# EAGLE design Hypnos V3.2 (EAGLE 9.6.2)
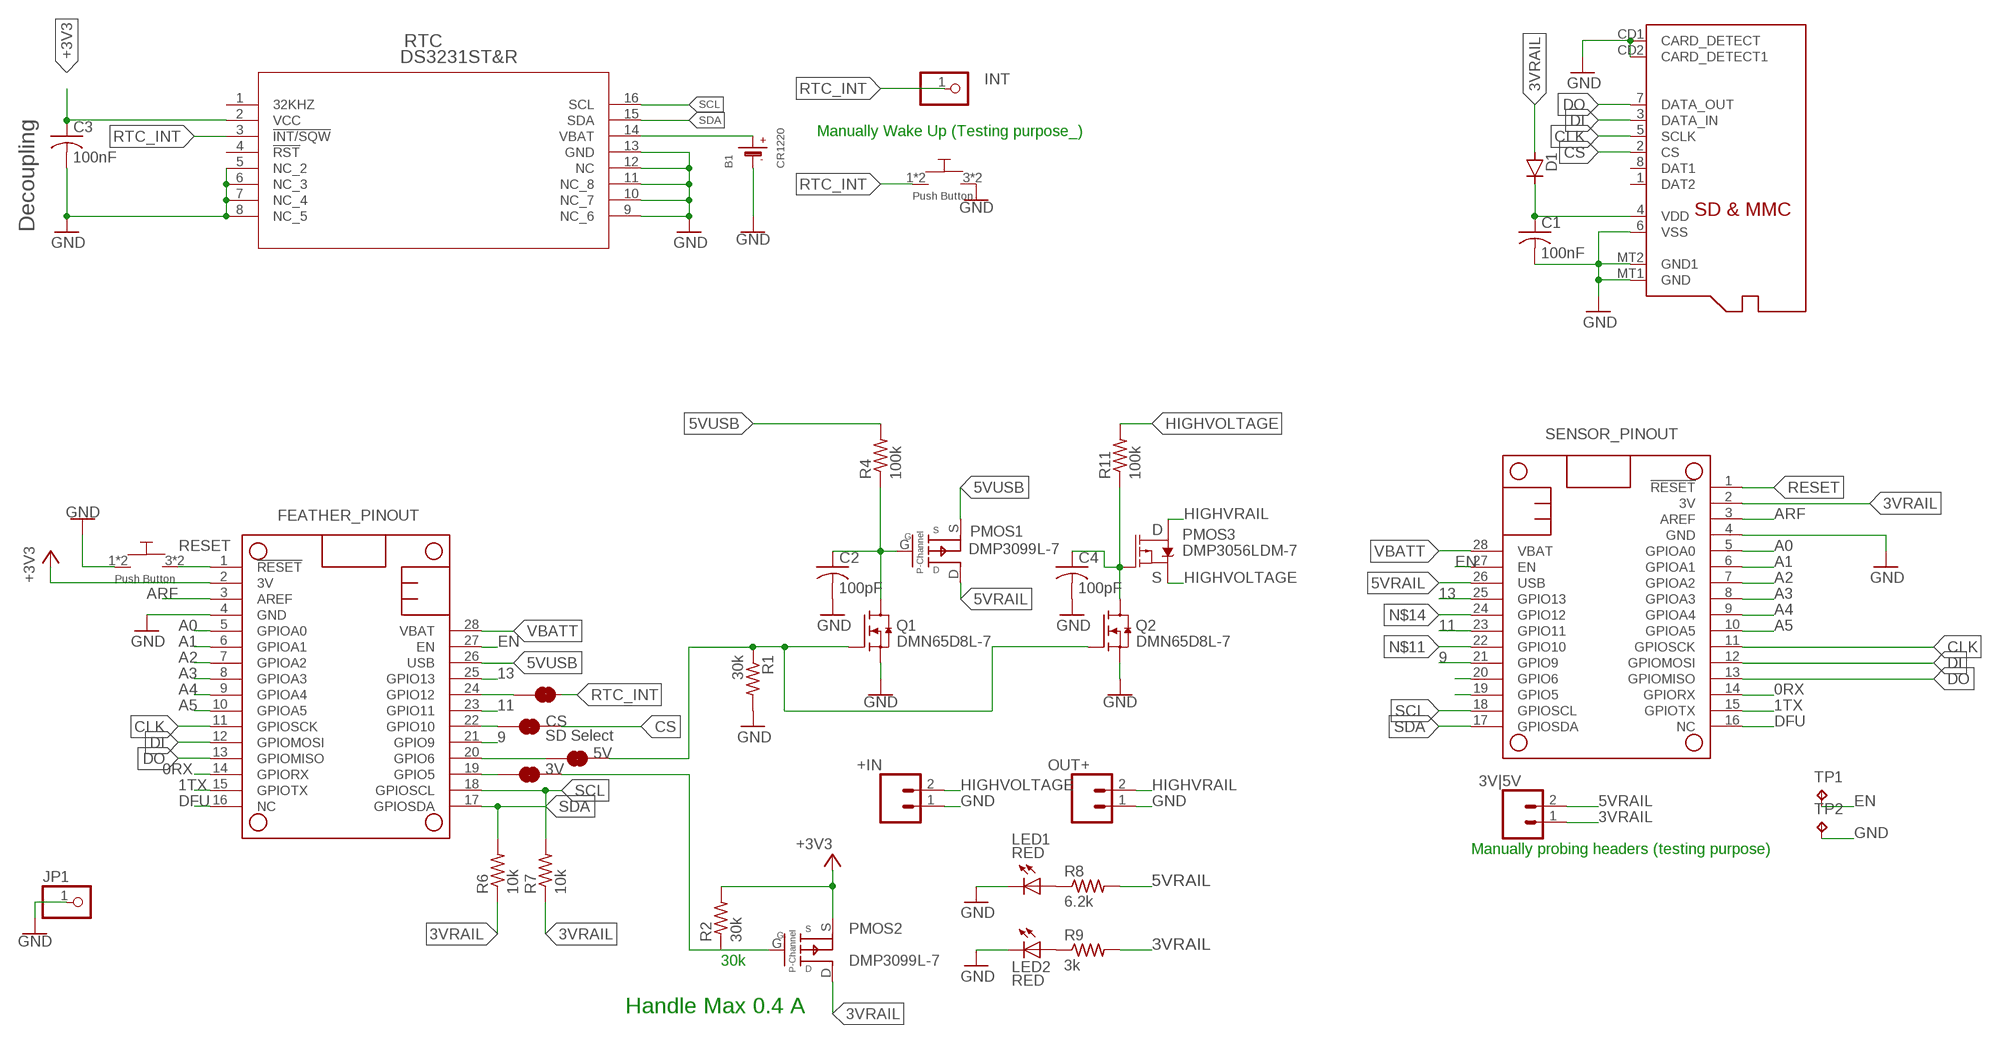
[diagram p0: schematic, sheet 1]

## Parts
3V  JUMPER-SMT_2_NC_TRACE_SILK  [SMT-JUMPER_2_NC_TRACE_SILK]
3V|5V  CONN_021X02_NO_SILK  [1X02_NO_SILK]
5V  JUMPER-SMT_2_NC_TRACE_SILK  [SMT-JUMPER_2_NC_TRACE_SILK]
+IN  HIGHV-IN  CONN_021X02_NO_SILK  [1X02_NO_SILK]
B1  CR1220  BATTERYCR1220_SMT  [CR1220]
C1  100nF  C-USC1206  [C1206]
C2  100pF  C-USC0805  [C0805]
C3  100nF  C-USC1206  [C1206]
C4  100pF  C-USC0805  [C0805]
CS  SD Select  JUMPER-SMT_2_NC_TRACE_SILK  [SMT-JUMPER_2_NC_TRACE_SILK]
D1  D-SOD123  [SOD123]
FEATHERWING  SENSOR_PINOUT  FEATHERWING  [FEATHERWING]
INT  PINHD-1X1CB  [1X01-CLEANBIG]
JP1  PINHD-1X1CB  [1X01-CLEANBIG]
LED1  RED  LEDCHIPLED_0805  [CHIPLED_0805]
LED2  RED  LEDCHIPLED_0805  [CHIPLED_0805]
MICROSD  MICROSD  [MICROSD]
MS2  FEATHER_PINOUT  FEATHERWING  [FEATHERWING]
OUT+  HIGHV-OUT  CONN_021X02_NO_SILK  [1X02_NO_SILK]
PMOS1  DMP3099L-7  SSM3J3228R  [SOT-23-3]
PMOS2  DMP3099L-7  SSM3J3228R  [SOT-23-3]
PMOS3  DMP3056LDM-7  P-MOSFET  [SOT23-6]
Q1  DMN65D8L-7  NMOS  [SOT23-S]
Q2  DMN65D8L-7  NMOS  [SOT23-S]
R1  30k  WSLP1206R0500FEA  [RES_1206]
R2  30k  WSLP1206R0500FEA  [RES_1206]
R4  100k  WSLP1206R0500FEA  [RES_1206]
R6  10k  WSLP1206R0500FEA  [RES_1206]
R7  10k  WSLP1206R0500FEA  [RES_1206]
R8  6.2k  WSLP1206R0500FEA  [RES_1206]
R9  3k  WSLP1206R0500FEA  [RES_1206]
R11  100k  WSLP1206R0500FEA  [RES_1206]
RTC  DS3231ST&R  [21-0042B_16]
RTC_INT  JUMPER-SMT_2_NC_TRACE_SILK  [SMT-JUMPER_2_NC_TRACE_SILK]
TP1  TPTP16R  [TP16R]
TP2  TPTP16R  [TP16R]
U$1  PUSH_BUTTON  [PUSHBUTTON_SMD]
U$2  PUSH_BUTTON  [PUSHBUTTON_SMD]

## Nets
0RX: FEATHERWING.14(GPIORX) MS2.14(GPIORX)
1TX: FEATHERWING.15(GPIOTX) MS2.15(GPIOTX)
3VRAIL: 3V|5V.1 D1.2(A) FEATHERWING.2(3V) PMOS2.D R6.1 R7.1 R9.2
5VRAIL: 3V|5V.2 FEATHERWING.26(USB) PMOS1.D R8.2
5VUSB: MS2.26(USB) PMOS1.S R4.2
9: FEATHERWING.21(GPIO9) MS2.21(GPIO9)
11: FEATHERWING.23(GPIO11) MS2.23(GPIO11)
13: FEATHERWING.25(GPIO13) MS2.25(GPIO13)
+3V3: C3.1 MS2.2(3V) PMOS2.S R2.2 RTC.2(VCC)
A0: FEATHERWING.5(GPIOA0) MS2.5(GPIOA0)
A1: FEATHERWING.6(GPIOA1) MS2.6(GPIOA1)
A2: FEATHERWING.7(GPIOA2) MS2.7(GPIOA2)
A3: FEATHERWING.8(GPIOA3) MS2.8(GPIOA3)
A4: FEATHERWING.9(GPIOA4) MS2.9(GPIOA4)
A5: FEATHERWING.10(GPIOA5) MS2.10(GPIOA5)
ARF: FEATHERWING.3(AREF) MS2.3(AREF)
CLK: FEATHERWING.11(GPIOSCK) MICROSD.5(SCLK) MS2.11(GPIOSCK)
CS: CS.2 MICROSD.2(CS)
DFU: FEATHERWING.16(NC) MS2.16(NC)
DI: FEATHERWING.12(GPIOMOSI) MICROSD.3(DATA_IN) MS2.12(GPIOMOSI)
DO: FEATHERWING.13(GPIOMISO) MICROSD.7(DATA_OUT) MS2.13(GPIOMISO)
EN: FEATHERWING.27(EN) MS2.27(EN) TP1.TP
GND [GND]: +IN.1 B1.- C1.2 C2.2 C3.2 C4.2 FEATHERWING.4(GND) JP1.1 LED1.C LED2.C MICROSD.6(VSS) MICROSD.CD1(CARD_DETECT) MICROSD.CD2(CARD_DETECT1) MICROSD.MT1(GND) MICROSD.MT2(GND1) MS2.4(GND) OUT+.1 Q1.2(S) Q2.2(S) R1.2 RTC.5(NC_2) RTC.6(NC_3) RTC.7(NC_4) RTC.8(NC_5) RTC.9(NC_6) RTC.10(NC_7) RTC.11(NC_8) RTC.12(NC) RTC.13(GND) TP2.TP U$1.1 U$1.2 U$2.3 U$2.4
HIGHVOLTAGE [HIGHVOLTAGE]: +IN.2 PMOS3.4(S) R11.2
HIGHVRAIL [HIGHVOLTAGE]: OUT+.2 PMOS3.1(D) PMOS3.2(D) PMOS3.5(D) PMOS3.6(D)
N$1: 5V.1 MS2.20(GPIO6)
N$2: B1.+$1(+) RTC.14(VBAT)
N$3: 3V.1 MS2.19(GPIO5)
N$4: 5V.2 Q1.1(G) Q2.1(G) R1.1
N$5: 3V.2 PMOS2.G R2.1
N$7: FEATHERWING.20(GPIO6)
N$8: FEATHERWING.19(GPIO5)
N$10: C2.1 PMOS1.G Q1.3(D) R4.1
N$11: CS.1 FEATHERWING.22(GPIO10) MS2.22(GPIO10)
N$12: LED1.A R8.1
N$13: LED2.A R9.1
N$14: FEATHERWING.24(GPIO12) MS2.24(GPIO12) RTC_INT.1
N$15: C4.1 PMOS3.3(G) Q2.3(D) R11.1
RESET: FEATHERWING.1(!RESET) MS2.1(!RESET) U$1.3 U$1.4
RTC_INT: INT.1 RTC.3(!INT/SQW) RTC_INT.2 U$2.1 U$2.2
SCL: FEATHERWING.18(GPIOSCL) MS2.18(GPIOSCL) R7.2 RTC.16(SCL)
SDA: FEATHERWING.17(GPIOSDA) MS2.17(GPIOSDA) R6.2 RTC.15(SDA)
VBATT: FEATHERWING.28(VBAT) MS2.28(VBAT)
VDD: C1.1 D1.1(C) MICROSD.4(VDD)
Unconnected: MICROSD.1(DAT2) MICROSD.8(DAT1) RTC.1(32KHZ) RTC.4(!RST)

## Notes on the sheet
- Manually Wake Up (Testing purpose_)
- Decoupling
- D
- S
- Manually probing headers (testing purpose)
- 30k
- Handle Max 0.4 A

## Library data of the parts
3V 5V CS RTC_INT = SparkFun-Jumpers:JUMPER-SMT_2_NC_TRACE: Normally closed trace jumper This jumper has a trace between two pads so it's normally closed (NC). Use a razor knife to open the connection. For best results follow the IPC guidelines for cutting traces: Cutout at least 0.063 mm (0.005 in). Remove all loose material to clean up the cut area. Seal the cut with an approved epoxy. Reapply solder to reclose the connection.
3V|5V +IN OUT+ = SparkFun-Connectors:CONN_02: Multi connection point. Often used as Generic Header-pin footprint for 0.1 inch spaced/style header connections On any of the 0.1 inch spaced packages, you can populate with these: Break Away Headers - Straight <https://www.sparkfun.com/products/116> (PRT-00116) Break Away Male Headers - Right Angle <https://www.sparkfun.com/products/553> (PRT-00553) Female Headers <https://www.sparkfun.com/products/115> (PRT-00115) Break Away Headers - Machine Pin <https://www.sparkfun.com/products/117> (PRT-00117) Break Away Female Headers - Swiss Machine Pin <https://www.sparkfun.com/products/743> (PRT-00743) For SCREWTERMINALS and SPRING TERMINALS visit here: Screw Terimnals on SparkFun.com <https://www.sparkfun.com/search/results?term=Screw+Terminals> (5mm/3.5mm/2.54mm spacing) This device is also useful as a general connection point to wire up your design to another part of your project. Our various solder wires solder well into these plated through hole pads. Hook-Up Wire - Assortment (Stranded, 22 AWG) <https://www.sparkfun.com/products/11375> (PRT-11375) Hook-Up Wire - Assortment (Solid Core, 22 AWG) <https://www.sparkfun.com/products/11367> (PRT-11367) View the entire wire category on our website here <https://www.sparkfun.com/categories/141> Special notes: Molex polarized connector foot print use with: PRT-08233 with associated crimp pins and housings. 2.54_SCREWTERM for use with PRT-10571. 3.5mm Screw Terminal footprints for PRT-08084 5mm Screw Terminal footprints for use with PRT-08432
B1 = microbuilder:BATTERY: CR1220 SMT - Digikey: 3001K-ND CD2032 BAT-HLD-001 - Digikey: BAT-HLD-001-ND
C1 C3 = adafruit:C-US: CAPACITOR, American symbol
C2 C4 = resistor:C-US: CAPACITOR, American symbol
D1 = semicon-smd-ipc:D-: DIODE unfilled
FEATHERWING = powerboard:FEATHERWING: Feather form factor pinout, 28 pins Forked from: https://github.com/adafruit/Adafruit-Eagle-Library
INT JP1 = adafruit:PINHD-1X1: Pin header 1x1 for 0.1" spacing With round pins
LED1 LED2 = adafruit:LED: LED OSRAM: - CHIPLED LG R971, LG N971, LY N971, LG Q971, LY Q971, LO R971, LY R971 LH N974, LH R974 LS Q976, LO Q976, LY Q976 LO Q996 - Hyper CHIPLED LW Q18S LB Q993, LB Q99A, LB R99A - SideLED LS A670, LO A670, LY A670, LG A670, LP A670 LB A673, LV A673, LT A673, LW A673 LH A674 LY A675 LS A676, LA A676, LO A676, LY A676, LW A676 LS A679, LY A679, LG A679 - Hyper Micro SIDELED® LS Y876, LA Y876, LO Y876, LY Y876 LT Y87S - SmartLED LW L88C, LW L88S LB L89C, LB L89S, LG L890 LS L89K, LO L89K, LY L89K LS L896, LA L896, LO L896, LY L896 - TOPLED LS T670, LO T670, LY T670, LG T670, LP T670 LSG T670, LSP T670, LSY T670, LOP T670, LYG T670 LG T671, LOG T671, LSG T671 LB T673, LV T673, LT T673, LW T673 LH T674 LS T676, LA T676, LO T676, LY T676, LB T676, LH T676, LSB T676, LW T676 LB T67C, LV T67C, LT T67C, LS T67K, LO T67K, LY T67K, LW E67C LS E67B, LA E67B, LO E67B, LY E67B, LB E67C, LV E67C, LT E67C LW T67C LS T679, LY T679, LG T679 LS T770, LO T770, LY T770, LG T770, LP T770 LB T773, LV T773, LT T773, LW T773 LH T774 LS E675, LA E675, LY E675, LS T675 LS T776, LA T776, LO T776, LY T776, LB T776 LHGB T686 LT T68C, LB T68C - Hyper Mini TOPLED® LB M676 - Mini TOPLED Santana® LG M470 LS M47K, LO M47K, LY M47K Source: http://www.osram.convergy.de/
MICROSD = adafruit:MICROSD: Micro-SD / Transflash card holder with SPI pinout For the 3M # 2908-05WB-MG and/or 4UCON #19656 push-push type
MS2 = adafruit:FEATHERWING
PMOS1 PMOS2 = M0_Power:SSM3J3228R: PMOS 3.8A (Ta) 1.08W (Ta) Surface Mount SOT-23, 3 pins Source: https://www.digikey.com/en/products/detail/diodes-incorporated/DMP3099L-7/4471075?s=N4IgTCBcDaICIFkAKBmADATgwGQLQHY4BJAYQBVcA5OEAXQF8g Part #: DMP3099L-7DICT-ND; PMOS: P-MOSFET
PMOS3 = eDNA:P-MOSFET: P-Channel 30V 4.3A (Ta) 1.25W (Ta) Surface Mount SOT-26, 6 pins https://www.digikey.com/product-detail/en/diodes-incorporated/DMP3056LDM-7/DMP3056LDMDICT-ND/1964772 Part #: DMP3056LDMDICT-ND
Q1 Q2 = eDNA:NMOS: N-Channel 310mA (Ta) 370mW (Ta) Surface Mount SOT-23, 3 pins https://www.digikey.com/en/products/detail/diodes-incorporated/DMN65D8L-7/3677916 Part #: DMN65D8L-7DICT-ND
R1 R2 R4 R6-R9 R11 = Resistor_Capacitor:WSLP1206R0500FEA: RES 0.05 OHM 1% 1W 1206 Manufacturer's datasheet <http://www.vishay.com/docs/30122/wslp.pdf>; CREATED_BY: PCBLayout.com; DIGIKEY_PART_NUMBER: WSLP-.05TR-ND; MANUFACTURER: Vishay Dale; MPN: WSLP1206R0500FEA; PACKAGE: SMD 1206
RTC = power8:DS3231ST&R: DS3231 RTC IC only, 16 pins Source: https://www.digikey.com/en/products/detail/maxim-integrated/DS3231SN-T-R/1197577?s=N4IgTCBcDaICIGUDMYkEYEDkDEAVAZAEoDCuAtJnCALoC%2BQA Part #: DS3231SN#T&RCT-ND; MANUFACTURER_PART_NUMBER: DS3231S#T&R; VENDOR: Maxim Integrated Products
TP1 TP2 = testpad:TP: Test pad
U$1 U$2 = eDNA:PUSH_BUTTON: SMD low profile push-button NOPE https://www.mouser.com/ProductDetail/ALPS/SKTHAHE010?qs=sGAEpiMZZMsgGjVA3toVBFPD9IcV2kPoEtmOqlcDILk%3D https://www.digikey.com/product-detail/en/c-k/KMR731NG-LFS/CKN10687TR-ND/6035353 https://www.arrow.com/en/products/kmr731nglfs/ck https://www.mouser.com/ProductDetail/CK/KMR731NGLFS?qs=%2Fha2pyFaduiYmAh2YH01EjoHSsd%2F4x%252BsVgk0GVi4JwmLxfMBh2nzdw%3D%3D

## Net classes
2 HIGHVOLTAGE: clearance 0.3 mm
3 sig: width 0.152 mm, clearance 0.152 mm

## Board
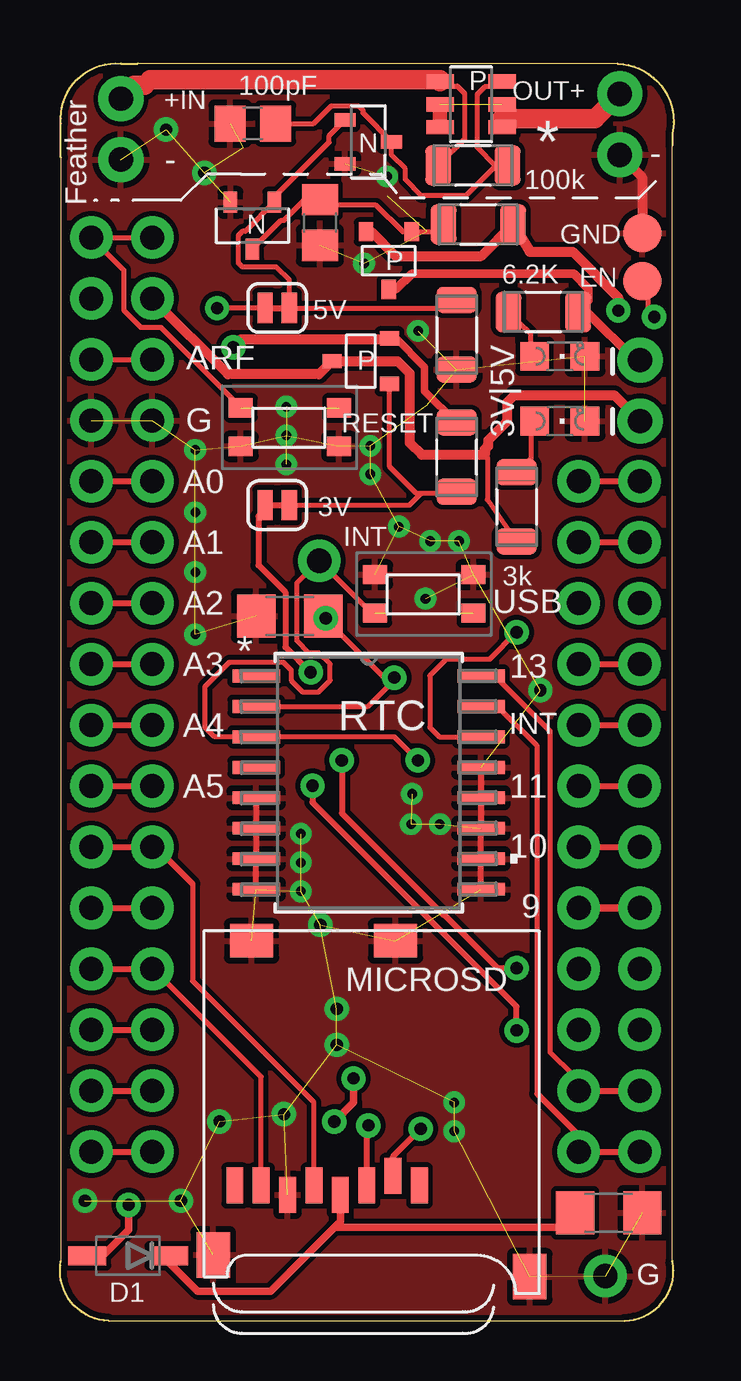
[diagram p1: board, top side]
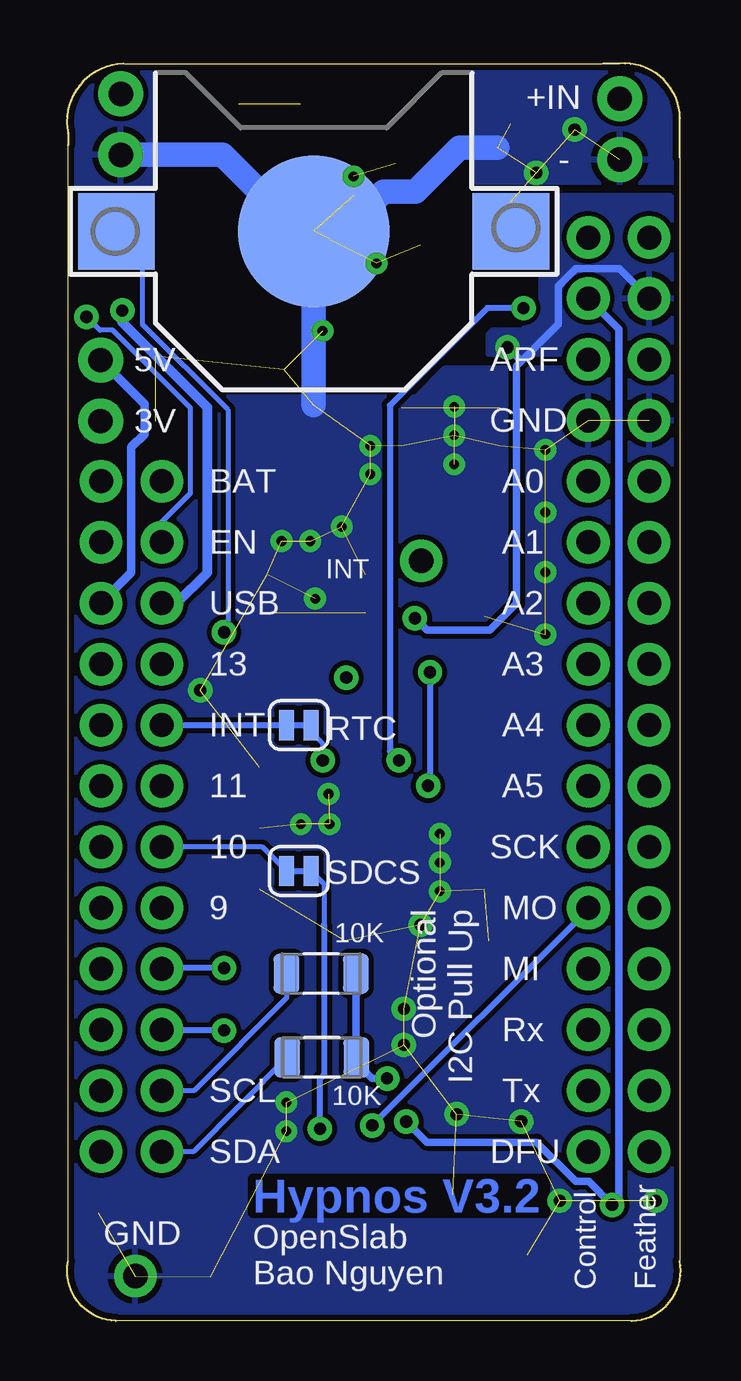
[diagram p2: board, bottom side, seen from below]

Size 25.59 x 52.41 mm. Coordinates in mm from the lower left corner, seen from the top.
Outline: 2.04,0 23.54,0 arc100 25.54,2.5 25.54,49 25.54,49.5 arc100 23.24,52.4 3.24,52.4 2.54,52.4 arc100 0.04,49.9 0.04,48.5 0.04,2.5 arc100 2.04,0
Copper layers (1*16): Top 0.035mm / dielectric 1.5mm / Bottom 0.035mm
Design rules "SparkFun": minimum track width 8mil, minimum drill 20mil, track to track 8mil, track to pad 8mil, pad to pad 8mil, via to via 8mil, smd to smd 8mil, copper to edge 10mil, drill to drill 8mil, minimum pad ring 12mil, minimum via ring 10mil, stop-mask expansion 4mil, vias tented up to drill 25mil, thermal gap 10mil

### Footprints (pad centres in the part's own frame; a part is rotated, then mirrored left to right if it is on the bottom)
SMT-JUMPER_2_NC_TRACE_SILK = smd 0.635 x 1.27: 1 -0.508,0; 2 0.508,0
1X02_NO_SILK = drill 1.016 pad 1.88: 1 0,0; 2 2.54,0
CR1220 = smd 3.2 x 3.2: +$1 -8.225,0; +$2 8.225,0 | smd 6.35 x 6.35: - 0,0
C1206 = smd 1.6 x 1.8: 1 -1.4,0; 2 1.4,0
C0805 = smd 1.3 x 1.5: 1 -0.95,0; 2 0.95,0
SOD123 = smd 1.6 x 0.8: 1 -1.7,0; 2 1.7,0
FEATHERWING = drill 1 pad 1.778: 1 6.35,1.27; 2 8.89,1.27; 3 11.43,1.27; 4 13.97,1.27; 5 16.51,1.27; 6 19.05,1.27; 7 21.59,1.27; 8 24.13,1.27; 9 26.67,1.27; 10 29.21,1.27; 11 31.75,1.27; 12 34.29,1.27; 13 36.83,1.27; 14 39.37,1.27; 15 41.91,1.27; 16 44.45,1.27; 17 44.45,21.59; 18 41.91,21.59; 19 39.37,21.59; 20 36.83,21.59; 21 34.29,21.59; 22 31.75,21.59; 23 29.21,21.59; 24 26.67,21.59; 25 24.13,21.59; 26 21.59,21.59; 27 19.05,21.59; 28 16.51,21.59
1X01-CLEANBIG = drill 1.016 pad 1.778: 1 0,0
CHIPLED_0805 = smd 1.2 x 1.2: A 0,-1.05; C 0,1.05
MICROSD = smd 0.7 x 1.5: 1 9,-10.64; 2 7.9,-10.24; 3 6.8,-10.64; 4 5.7,-11.04; 5 4.6,-10.64; 6 3.5,-11.04; 7 2.4,-10.64; 8 1.3,-10.64 | smd 1.8 x 1.4: CD1 2,-0.44; CD2 8,-0.44 | smd 1.4 x 1.9: MT1 0.4,-13.54; MT2 13.6,-14.44
SOT-23-3 = smd 0.8 x 0.6: D 1.2,0; G -1.2,0.95; S -1.2,-0.95
SOT23-6 = smd 1.146 x 0.597: 1 -1.287,0.95; 2 -1.287,0; 3 -1.287,-0.95; 4 1.287,-0.95; 5 1.287,0; 6 1.287,0.95
SOT23-S = smd 0.88 x 0.569: 1 -0.975,0.915; 2 -0.975,-0.915; 3 0.975,0
RES_1206 = smd 1.08 x 1.68: 1 -1.445,0; 2 1.445,0
21-0042B_16 = smd 1.981 x 0.533: 1 -4.686,4.445; 2 -4.686,3.175; 3 -4.686,1.905; 4 -4.686,0.635; 5 -4.686,-0.635; 6 -4.686,-1.905; 7 -4.686,-3.175; 8 -4.686,-4.445; 9 4.686,-4.445; 10 4.686,-3.175; 11 4.686,-1.905; 12 4.686,-0.635; 13 4.686,0.635; 14 4.686,1.905; 15 4.686,3.175; 16 4.686,4.445
TP16R = smd 1.6 x 1.6: TP 0,0
PUSHBUTTON_SMD = smd 1 x 0.8: 1 0,-1.6; 2 4.1,-1.6; 3 0,0; 4 4.1,0

### Placement (x,y rotation side)
3V  9.06,34 0 top
3V|5V  24.19,37.5 90 bottom
5V  9.06,42.22 0 top
+IN  2.54,48.4 90 top
B1  15.3,45.41 0 bottom
C1  22.88,4.5 0 top
C2  10.84,45.77 270 top
C3  9.58,29.38 180 top
C4  8.04,49.9 180 top
CS  15.92,18.75 0 bottom
D1  2.84,2.71 180 top
FEATHERWING  2.58,51.5 270 top
INT  10.81,31.68 0 top
JP1  22.74,1.86 0 top
LED1  20.84,40.2 270 top
LED2  20.84,37.5 270 top
MICROSD  5.99,16.28 0 top
MS2  0.04,51.5 270 top
OUT+  23.34,48.6 90 top
PMOS1  13.71,44.19 270 top
PMOS2  12.54,40 180 top
PMOS3  17.14,50.7 180 top
Q1  8.02,45.65 270 top
Q2  12.86,49.14 0 top
R1  16.54,41.1 270 top
R2  16.54,36 90 top
R4  17.44,45.7 0 top
R6  14.96,10.98 180 bottom
R7  14.99,14.47 180 bottom
R8  20.15,42.05 0 top
R9  19.04,33.93 270 top
R11  17.22,48.16 180 top
RTC  12.87,22.43 0 top
RTC_INT  15.92,24.83 0 bottom
TP1  24.28,43.33 0 top
TP2  24.28,45.33 0 top
U$1  7.54,38.05 0 top
U$2  13.14,31.1 0 top

### Tracks (layer width: path | path; a pad name or v marks a point on that pad's centre or on a via)
0RX
  Top 0.254: MS2.14 FEATHERWING.14
1TX
  Top 0.254: MS2.15 FEATHERWING.15
3VRAIL  (via drill 0.51)
  Top 0.203: R9.2 17.82,34.23 17.82,35.99 17.71,36.1
  Top 0.305: v2.86,4.83 2.86,3.79 1.78,2.71 D1.2 | v11.44,8.3 12.24,9.1 v12.24,10.1
  Top 0.406: 3V|5V.1 23.11,38.58 18.95,38.58 18.65,38.28 18.65,37.5 17.85,36.7 17.85,36.45 17.71,36.32 17.71,36.1 15.09,36.1 14.58,36.6 14.58,39.5 14.08,40 PMOS2.D 10.8,39.46 7,39.46 FEATHERWING.2
  Bottom 0.305: FEATHERWING.2 2.58,41.34 2.58,5.11 v2.86,4.83 3.84,5.8 4.37,5.8 6.01,7.45 10.59,7.45 v11.44,8.3 | v12.24,10.1 12.87,10.1 13.52,10.75 R6.1 13.55,11.01 R7.1
5VRAIL
  Top 0.305: 22.04,42.52 R8.2 | PMOS1.D 14.02,42.99
  Top 0.355: 22.04,42.52 22.04,43.03 21.42,43.65 14.68,43.65 14.02,42.99 | 3V|5V.2 23.98,40.04 21.97,42.05 R8.2
  Bottom 0.355: 3V|5V.2 22.35,38.2 22.35,36.96 22.9,36.41 22.9,31.18 FEATHERWING.26
5VUSB  (via drill 0.51)
  Top 0.406: v23.28,42.11 23.28,42.65 21.37,44.56 19.58,44.56 R4.2 17.57,44.38 13.99,44.38 12.99,45.39 PMOS1.S
  Bottom 0.305: 23.28,41.62 v23.28,42.11
  Bottom 0.406: MS2.26 21.02,29.91 19.73,31.2 19.73,38.07 23.28,41.62
9
  Top 0.305: MS2.21 FEATHERWING.21
11
  Top 0.254: MS2.23 FEATHERWING.23
13
  Top 0.254: MS2.25 FEATHERWING.25
+3V3  (via drill 0.51)
  Top 0.203: C3.1 10.98,29.33 13.5,26.81 v13.94,26.81 13.94,26.71 12.84,25.61 RTC.2
  Top 0.305: 13.69,40.9 PMOS2.S 14.01,40.95 15.2,39.76 15.2,38.76 R2.2 | v11.08,29.29 C3.1
  Top 0.406: 13.69,40.9 7.55,40.9 v7.23,40.58
  Bottom 0.305: 6.65,39.99 v7.23,40.58 | 6.65,39.99 5.1,41.55 5.1,43.13 4.37,43.85 2.56,43.85 MS2.2 | 6.65,39.99 6.84,39.8 6.84,29.9 7.96,28.79 10.58,28.79 v11.08,29.29
  pour Bottom: 0.24,40.3 0.24,46.7 0.44,46.9 5.84,46.9 5.84,42.1 6.64,41.3 7.84,41.3 8.04,41.1 8.04,40.3
A0
  Top 0.254: MS2.5 FEATHERWING.5
A1
  Top 0.254: MS2.6 FEATHERWING.6
A2
  Top 0.254: MS2.7 FEATHERWING.7
A3
  Top 0.254: MS2.8 FEATHERWING.8
A4
  Top 0.254: MS2.9 FEATHERWING.9
A5
  Top 0.254: MS2.10 FEATHERWING.10
ARF
  Top 0.203: MS2.3 FEATHERWING.3
CLK
  Top 0.203: MICROSD.5 10.59,9.1 5.53,14.16 5.53,18.21
  Top 0.254: 5.53,18.21 3.99,19.75 FEATHERWING.11 MS2.11
CS  (via drill 0.51)
  Top 0.254: v15.04,8 13.89,6.85 MICROSD.2
  Bottom 0.203: CS.2 14.87,18.21 14.87,16.52
  Bottom 0.254: v15.04,8 15.04,10.08 14.87,10.25 14.87,16.52
DFU
  Top 0.254: MS2.16 FEATHERWING.16
DI  (via drill 0.51)
  Top 0.254: v12.86,8.14 12.79,8.07 MICROSD.3 | MS2.12 FEATHERWING.12
  Bottom 0.254: v12.86,8.14 3.85,17.15 FEATHERWING.12
DO
  Top 0.203: FEATHERWING.13 3.89,14.67 | MICROSD.7 8.39,10.17 4.05,14.51
  Top 0.254: MS2.13 3.89,14.67 4.05,14.51
EN  (via drill 0.51)
  Top 0.203: v24.78,41.84 24.52,42.1 24.52,42.84 24.24,43.12 24.24,43.33 TP1.TP
  Top 0.254: MS2.27 FEATHERWING.27
  Bottom 0.203: v24.78,41.84 24.22,41.28 23.67,41.28 20.44,38.05 20.44,34.5 21.63,33.3 MS2.27
GND  (via drill 0.4, 0.51)  (58 unrouted)
  Top 0.254: RTC.8 RTC.7 RTC.6 RTC.5 | RTC.9 RTC.10 RTC.11 RTC.12 RTC.13
  Top 0.406: OUT+.1 24.28,47.66 TP2.TP
  Bottom 0.406: v13.64,47.7 13.64,46.9
  Bottom 0.813: 14.05,46.66 B1.- 15.9,45.41
  Bottom 1.016: B1.- 15.3,38.16 | 14.05,46.66 13.2,46.66 13,46.46 12.4,47.06 11.06,47.06 9.22,48.9 7.64,48.9 | 15.9,45.41 19.09,48.6 OUT+.1
  other vias: 9.34,8.61 14.68,21.96 14.13,33.1 10.85,16.5 4.42,49.65 20.03,26.28 6.65,8.31 11.54,13 5.04,5 1.04,5 11.54,11.5 12.94,36.47 12.94,35.29 12.68,44.08 9.44,38.1 9.44,36.9 9.44,35.7 14.64,20.7 15.84,20.7 15.44,32.5 16.64,32.5 15.24,30.1 10.04,20.3 10.04,19.1 10.04,17.9 16.44,9.1 16.44,7.9 14.93,41.26 6.02,47.85 5.64,33.7 5.64,36.3 5.64,31.2 5.64,28.61
  pour Top: -0.46,52.5 26.04,52.5 26.04,-0.5 -0.46,-0.5
  pour Bottom: -0.06,39.7 9.84,39.7 11.04,38.5 19.04,38.5 22.04,41.5 22.04,52 26.04,52 26.04,-0.5 -0.06,-0.5
  pour Bottom: 0.04,47.46 0.04,50.7 1.84,52.5 8.44,52.5 8.64,52.3 8.64,47.5 8.6,47.46
HIGHVOLTAGE
  Top 0.203: PMOS3.4 16.04,51.46 16.56,51.46 16.87,51.16 16.87,49.26 15.81,48.2 R11.2
  Top 0.813: +IN.2 3.1,51.5 3.53,51.5 3.77,51.74 15.85,51.74 PMOS3.4
HIGHVRAIL  (1 unrouted)
  Top 0.61: PMOS3.1 18.43,50.1 PMOS3.2 18.47,50.65 | PMOS3.5 PMOS3.6
  Top 0.813: OUT+.2 22.3,50.1 18.43,50.1
N$1  (via drill 0.51)
  Top 0.203: 8.49,42.16 5V.1 v6.55,42.21
  Top 0.254: v19.04,14.7 18.24,14.7 16.03,16.91 15.99,16.91 11.75,21.15 v11.75,23.36
  Bottom 0.254: v6.55,42.21 8.06,42.21 12.12,38.15 12.12,23.73 v11.75,23.36 | v19.04,14.7 21.6,14.7 MS2.20
N$2  (via drill 0.51)
  Top 0.203: RTC.14 15.82,24.34 15.42,24.74 15.42,26.89 16.1,27.57 17.91,27.57 v19.04,28.7
  Bottom 0.203: v19.04,28.7 18.87,28.87 18.87,37.97 22.45,41.55 22.45,44.33 B1.+$1
N$3  (via drill 0.51)
  Top 0.254: v10.45,27.03 9.4,28.08 9.4,30.37 8.28,31.49 8.28,33.53 8.55,33.8 3V.1 | v19.04,12.1 19.04,13.1 10.53,21.61 v10.53,22.3
  Bottom 0.254: v10.45,27.03 10.45,22.38 v10.53,22.3 | v19.04,12.1 21.6,12.1 MS2.19
N$4
  Top 0.203: R1.1 16.54,42.51 16.24,42.22 5V.2 9.56,43.38 9.01,43.93 7.61,43.93 7.43,44.1 7.43,45.24 7.61,45.41 7.73,45.41 Q1.1 8.94,46.84 11.22,49.12 11.22,49.39 Q2.1
N$5
  Top 0.203: 15.06,34.5 14.85,34.5 13.74,35.61 PMOS2.G | 15.06,34.5 16.46,34.5 R2.1 | 15.06,34.5 14.56,34 3V.2
N$10
  Top 0.203: R4.1 16.13,45.39 PMOS1.G 14.29,45.39 13.19,46.49 11.07,46.49 10.85,46.71 | 10.85,46.71 C2.1 | Q1.3 9.22,45.88 9.35,45.88 10.18,46.71 10.85,46.71
N$11
  Top 0.254: MS2.22 FEATHERWING.22
  Bottom 0.203: CS.1 17.43,19.75 MS2.22
N$12
  Top 0.203: LED1.A 19.62,40.38 19.62,41.16 R8.1
N$13
  Top 0.203: R9.1 19.64,35.95 19.64,37.35 LED2.A
N$14
  Top 0.254: MS2.24 FEATHERWING.24
  Bottom 0.254: MS2.24 RTC_INT.1
N$15
  Top 0.203: PMOS3.3 18.22,51.45 17.73,51.45 17.4,51.12 17.4,48.91 18.16,48.16 R11.1 18.19,48.16 16.94,46.91 15.07,46.91 14.4,47.58 14.4,48.01 13.83,48.58 Q2.3 12.63,50.34 12.63,50.47 12.45,50.64 11.31,50.64 10.57,49.9 C4.1
RESET  (1 unrouted)
  Top 0.203: FEATHERWING.1 MS2.1 2.6,43.86 2.66,43.8 2.66,42.12 3.36,41.42 4.2,41.42 7.54,38.08 U$1.3
RTC_INT  (via drill 0.51)  (1 unrouted)
  Top 0.203: v14.92,23.36 13.94,24.34 RTC.3 6.45,24.34 6.05,24.74 6.05,26.43 7.07,27.45 9.3,27.45 9.64,27.12 9.64,26.69 10.11,26.22 10.79,26.22 11.26,26.69 11.26,27.37 10.79,27.84 10.39,27.84 9.88,28.35 9.88,30.75 INT.1 11.91,30.59 12.99,29.5 U$2.1 | 17.27,29.48 U$2.2
  Bottom 0.203: RTC_INT.2 15.41,24.55 14.92,24.06 v14.92,23.36
SCL
  Top 0.203: RTC.16 17.62,26.82 18.21,26.82 20.43,24.59 20.43,11.19 21.42,10.2
  Top 0.254: FEATHERWING.18 MS2.18 21.63,9.99 21.42,10.2
  Bottom 0.203: R7.2 16.41,13.47 20.29,9.59 MS2.18
SDA
  Top 0.203: RTC.15 18.25,25.61 19.89,23.97 19.89,9.47
  Top 0.254: FEATHERWING.17 MS2.17 21.63,7.73 19.89,9.47
  Bottom 0.203: R6.2 20.31,7.05 MS2.17
VBATT
  Top 0.254: MS2.28 FEATHERWING.28
VDD
  Top 0.305: D1.1 4.54,2.44 5.74,1.23 8.77,1.23 11.44,3.9 | MICROSD.4 11.69,4.15 11.44,3.9 | C1.1 20.88,3.9 11.44,3.9

### Text on the board
Bottom: Hypnos V3.2
tPlace: 100pF | P | N | - | - | 100k | Feather | N | GND | P | 6.2K | EN | ARF | P | G | RESET | A0 | A1 | 3k | A2 | A3 | A4 | A5 | G
bPlace: +IN | - | ARF | 5V | GND | 3V | A0 | BAT | A1 | EN | INT | A2 | USB | A3 | 13 | RTC | A4 | INT | A5 | 11 | SCK | SDCS | 10 | Optional / I2C Pull Up | MO | 9 | 10K | MI | Rx | Tx | 10K | SCL | DFU | SDA | OpenSlab | GND | Feather | Control | Bao Nguyen
tNames: USB | 13 | INT | 11 | 10 | 9
bStop: Hypnos V3.2